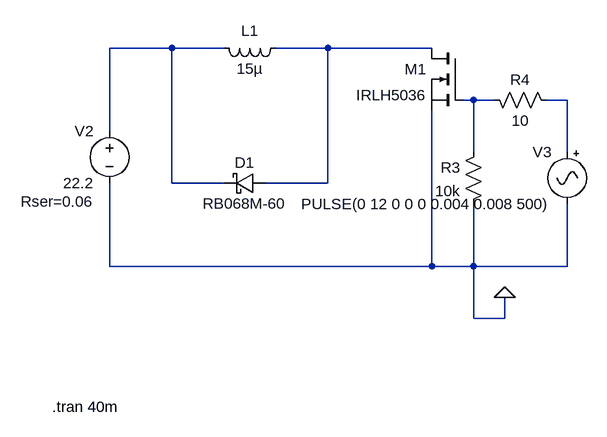
[diagram p0: schematic Draft1.asc]
Draft1.asc, the LTspice schematic file:
Version 4
SHEET 1 1288 680
WIRE -64 -80 -160 -80
WIRE 16 -80 -64 -80
WIRE 176 -80 96 -80
WIRE 336 -80 176 -80
WIRE 400 0 384 0
WIRE 432 0 400 0
WIRE 544 0 512 0
WIRE -160 48 -160 -80
WIRE 400 80 400 0
WIRE 544 80 544 0
WIRE -64 128 -64 -80
WIRE 16 128 -64 128
WIRE 176 128 176 -80
WIRE 176 128 80 128
WIRE -160 256 -160 128
WIRE 336 256 336 16
WIRE 336 256 -160 256
WIRE 400 256 400 160
WIRE 400 256 336 256
WIRE 544 256 544 160
WIRE 544 256 400 256
WIRE 400 336 400 256
WIRE 448 336 448 304
WIRE 448 336 400 336
FLAG 448 304 0
SYMBOL schottky 80 144 M270
WINDOW 0 32 32 VTop 2
WINDOW 3 0 32 VBottom 2
SYMATTR InstName D1
SYMATTR Value RB068M-60
SYMBOL nmos 384 -80 M0
SYMATTR InstName M1
SYMATTR Value IRLH5036
SYMBOL ind 0 -96 M90
WINDOW 0 5 56 VBottom 2
WINDOW 3 32 56 VTop 2
SYMATTR InstName L1
SYMATTR Value 15µ
SYMATTR SpiceLine Rser=0.16
SYMBOL voltage -160 32 M0
WINDOW 123 0 0 Left 2
WINDOW 39 24 124 Left 2
SYMATTR SpiceLine Rser=0.06
SYMATTR InstName V2
SYMATTR Value 22.2
SYMBOL res 416 64 M0
SYMATTR InstName R3
SYMATTR Value 10k
SYMBOL res 416 -16 M90
WINDOW 0 0 56 VBottom 2
WINDOW 3 32 56 VTop 2
SYMATTR InstName R4
SYMATTR Value 10
SYMBOL Misc\\signal 544 64 M0
WINDOW 123 0 0 Left 2
WINDOW 39 0 0 Left 2
SYMATTR InstName V3
SYMATTR Value PULSE(0 12 0 0 0 0.004 0.008 500)
TEXT -248 472 Left 2 !.tran 40m

The netlist it stands for:
* Draft1.asc
D1 N002 N001 RB068M-60
M1 N002 N003 0 0 IRLH5036
L1 N001 N002 15µ Rser=0.16
V2 N001 0 22.2 Rser=0.06
R3 N003 0 10k
R4 N003 N004 10
V3 N004 0 PULSE(0 12 0 0 0 0.004 0.008 500)
.model D D
.lib standard.dio
.model NMOS NMOS
.model PMOS PMOS
.lib standard.mos
.tran 40m
.backanno
.end